# EAGLE design electrophy_RHD (EAGLE 7.2.0)
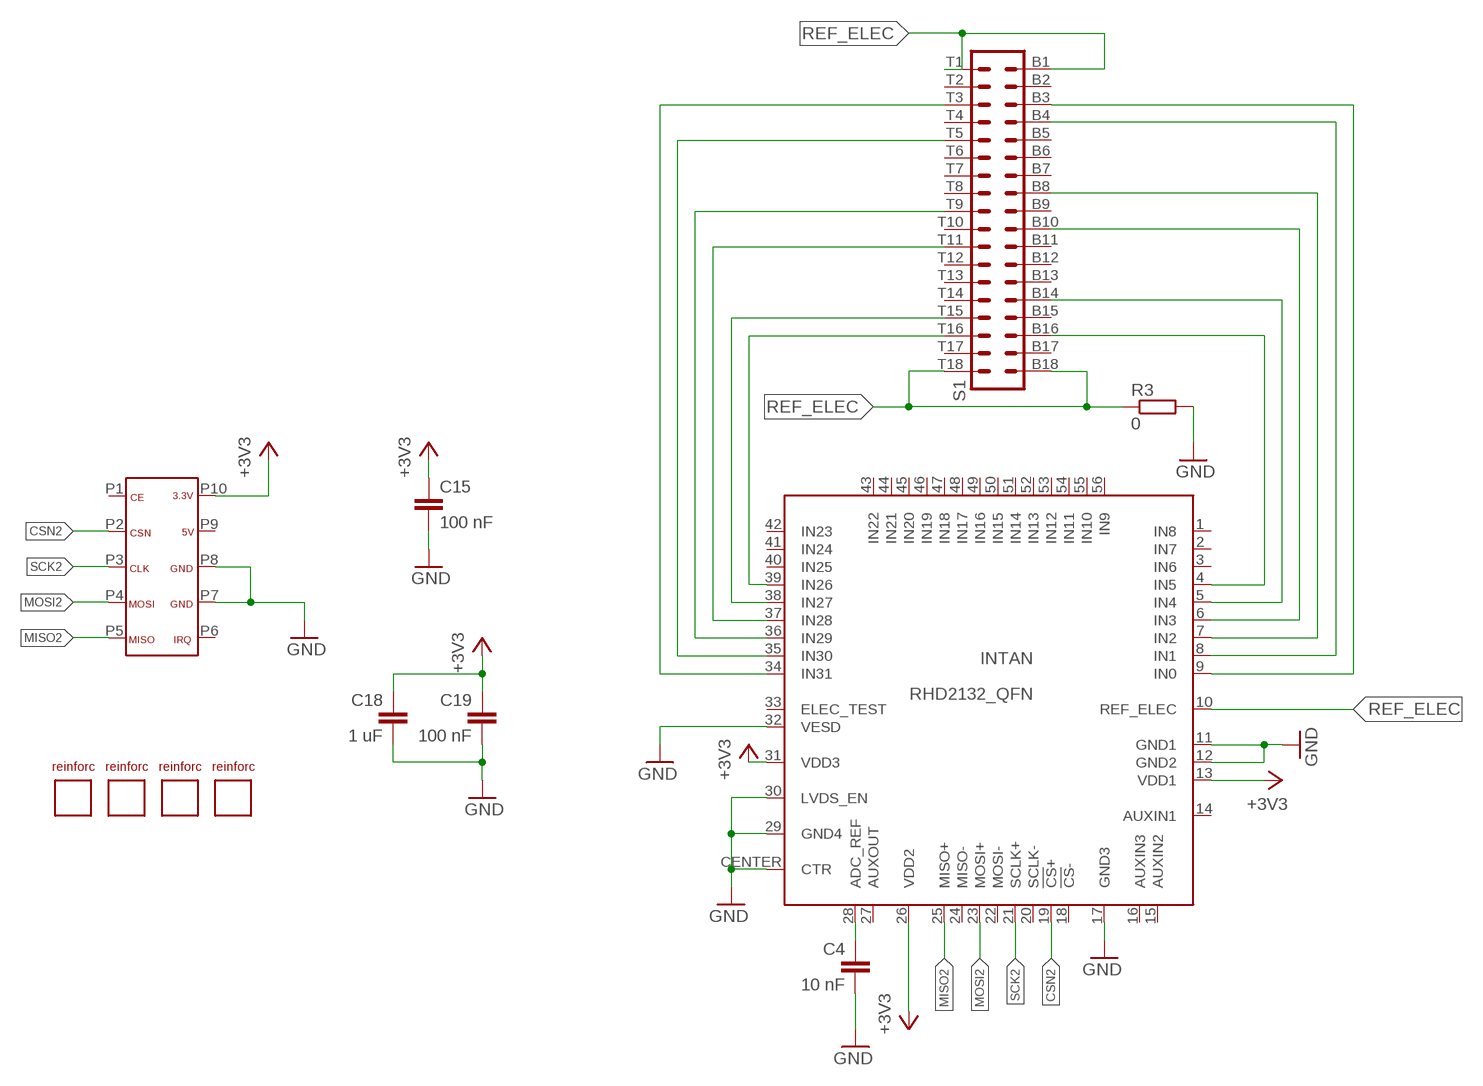
[diagram p0: schematic, sheet 1]

## Parts
C4  10 nF  C-EUC0603  [C0603]
C15  100 nF  C-EUC0603  [C0603]
C18  1 uF  C-EUC0603  [C0603]
C19  100 nF  C-EUC0603  [C0603]
INTAN  RHD2132_QFN  [QFN56_8_X_8_LARGE]
R3  0  R-EU_R0603  [R0603]
S1  OMNETICS_A79027  [OMNETICS_A79027]
U$1  DF12-10-FEMALE  [DF12-10-FEMALE]
U$2  REINFORCEMENT  [REINFORCEMENT]
U$3  REINFORCEMENT  [REINFORCEMENT]
U$4  REINFORCEMENT  [REINFORCEMENT]
U$5  REINFORCEMENT  [REINFORCEMENT]

## Nets
+3V3: C15.1 C18.1 C19.1 INTAN.13(VDD1) INTAN.26(VDD2) INTAN.31(VDD3) U$1.P10
CSN2: INTAN.19(!CS!+) U$1.P2
GND: C4.2 C15.2 C18.2 C19.2 INTAN.11(GND1) INTAN.12(GND2) INTAN.17(GND3) INTAN.29(GND4) INTAN.30(LVDS_EN) INTAN.32(VESD) INTAN.CENTER(CTR) R3.2 U$1.P7 U$1.P8
MISO2: INTAN.25(MISO+) U$1.P5
MOSI2: INTAN.23(MOSI+) U$1.P4
N$1: INTAN.4(IN5) S1.B16
N$2: INTAN.34(IN31) S1.T3
N$5: INTAN.35(IN30) S1.T5
N$6: INTAN.38(IN27) S1.T15
N$7: INTAN.39(IN26) S1.T16
N$11: C4.1 INTAN.28(ADC_REF)
N$12: INTAN.8(IN1) S1.B4
N$13: INTAN.9(IN0) S1.B3
N$15: INTAN.5(IN4) S1.B14
N$17: INTAN.7(IN2) S1.B8
N$20: INTAN.6(IN3) S1.B10
N$23: INTAN.36(IN29) S1.T9
N$26: INTAN.37(IN28) S1.T11
REF_ELEC: INTAN.10(REF_ELEC) R3.1 S1.B1 S1.B18 S1.T1 S1.T18
SCK2: INTAN.21(SCLK+) U$1.P3
Unconnected: INTAN.1(IN8) INTAN.2(IN7) INTAN.3(IN6) INTAN.14(AUXIN1) INTAN.15(AUXIN2) INTAN.16(AUXIN3) INTAN.18(!CS!-) INTAN.20(SCLK-) INTAN.22(MOSI-) INTAN.24(MISO-) INTAN.27(AUXOUT) INTAN.33(ELEC_TEST) INTAN.40(IN25) INTAN.41(IN24) INTAN.42(IN23) INTAN.43(IN22) INTAN.44(IN21) INTAN.45(IN20) INTAN.46(IN19) INTAN.47(IN18) INTAN.48(IN17) INTAN.49(IN16) INTAN.50(IN15) INTAN.51(IN14) INTAN.52(IN13) INTAN.53(IN12) INTAN.54(IN11) INTAN.55(IN10) INTAN.56(IN9) S1.B2 S1.B5 S1.B6 S1.B7 S1.B9 S1.B11 S1.B12 S1.B13 S1.B15 S1.B17 S1.T2 S1.T4 S1.T6 S1.T7 S1.T8 S1.T10 S1.T12 S1.T13 S1.T14 S1.T17 U$1.P1 U$1.P6 U$1.P9 U$2.P$1 U$3.P$1 U$4.P$1 U$5.P$1

## Library data of the parts
C4 C15 C18 C19 = resistor:C-EU: CAPACITOR, European symbol
INTAN = RHD2000:RHD2132: Intan Technologies RHD2132 chip
R3 = resistor:R-EU_: RESISTOR, European symbol
S1 = omnetics36:OMNETICS_A79027: Omnetics A79024 36-pin connector
U$1 = Hirose_DF12:DF12-10-FEMALE
U$2-U$5 = reinforcement:REINFORCEMENT

## Net classes
0 default: clearance 0.205 mm

## Board
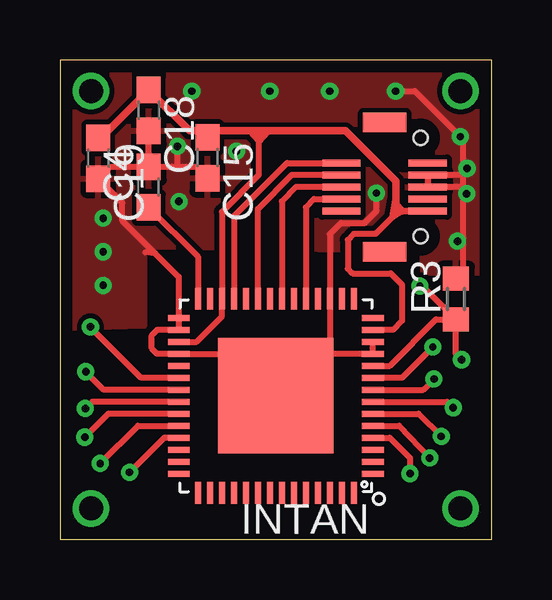
[diagram p1: board, top side]
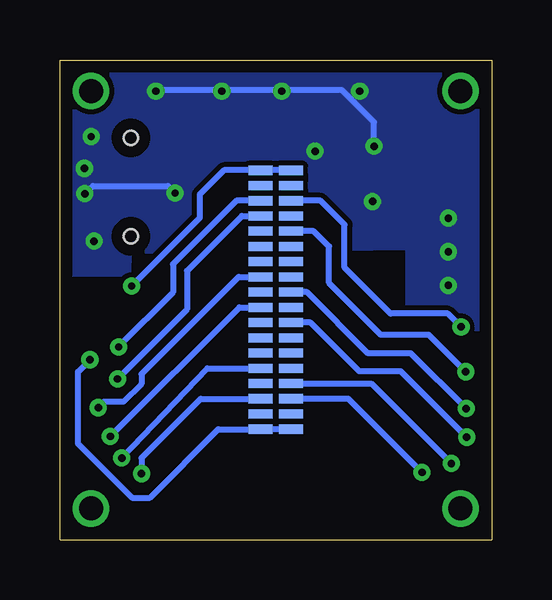
[diagram p2: board, bottom side, seen from below]

Size 18 x 20 mm. Coordinates in mm from the lower left corner, seen from the top.
Outline: 18,0 18,20 0,20 0,0 18,0
Copper layers (1*16): Top 0.035mm / dielectric 1.5mm / Bottom 0.035mm
Design rules "default *": minimum track width 8mil, minimum drill 12mil, track to track 8mil, track to pad 8mil, pad to pad 8mil, via to via 8mil, smd to smd 8mil, copper to edge 20mil, drill to drill 8mil, minimum pad ring 10mil, minimum via ring 8mil, stop-mask expansion 4mil, vias tented up to drill 12mil, thermal gap 10mil

### Footprints (pad centres in the part's own frame; a part is rotated, then mirrored left to right if it is on the bottom)
C0603 = smd 1.1 x 1: 1 -0.85,0; 2 0.85,0
QFN56_8_X_8_LARGE = smd 0.9 x 0.25: 1 -4.05,3.25; 2 -4.05,2.75; 3 -4.05,2.25; 4 -4.05,1.75; 5 -4.05,1.25; 6 -4.05,0.75; 7 -4.05,0.25; 8 -4.05,-0.25; 9 -4.05,-0.75; 10 -4.05,-1.25; 11 -4.05,-1.75; 12 -4.05,-2.25; 13 -4.05,-2.75; 14 -4.05,-3.25; 29 4.05,-3.25; 30 4.05,-2.75; 31 4.05,-2.25; 32 4.05,-1.75; 33 4.05,-1.25; 34 4.05,-0.75; 35 4.05,-0.25; 36 4.05,0.25; 37 4.05,0.75; 38 4.05,1.25; 39 4.05,1.75; 40 4.05,2.25; 41 4.05,2.75; 42 4.05,3.25 | smd 0.25 x 0.9: 15 -3.25,-4.05; 16 -2.75,-4.05; 17 -2.25,-4.05; 18 -1.75,-4.05; 19 -1.25,-4.05; 20 -0.75,-4.05; 21 -0.25,-4.05; 22 0.25,-4.05; 23 0.75,-4.05; 24 1.25,-4.05; 25 1.75,-4.05; 26 2.25,-4.05; 27 2.75,-4.05; 28 3.25,-4.05; 43 3.25,4.05; 44 2.75,4.05; 45 2.25,4.05; 46 1.75,4.05; 47 1.25,4.05; 48 0.75,4.05; 49 0.25,4.05; 50 -0.25,4.05; 51 -0.75,4.05; 52 -1.25,4.05; 53 -1.75,4.05; 54 -2.25,4.05; 55 -2.75,4.05; 56 -3.25,4.05 | smd 4.8 x 4.8: CENTER 0,0
R0603 = smd 1 x 1.1: 1 -0.85,0; 2 0.85,0
OMNETICS_A79027 = smd 0.381 x 1.016: B1 -5.397,-0.635; B2 -4.763,-0.635; B3 -4.128,-0.635; B4 -3.493,-0.635; B5 -2.857,-0.635; B6 -2.223,-0.635; B7 -1.587,-0.635; B8 -0.953,-0.635; B9 -0.318,-0.635; B10 0.318,-0.635; B11 0.953,-0.635; B12 1.587,-0.635; B13 2.223,-0.635; B14 2.857,-0.635; B15 3.493,-0.635; B16 4.128,-0.635; B17 4.763,-0.635; B18 5.397,-0.635; T1 -5.397,0.635; T2 -4.763,0.635; T3 -4.128,0.635; T4 -3.493,0.635; T5 -2.857,0.635; T6 -2.223,0.635; T7 -1.587,0.635; T8 -0.953,0.635; T9 -0.318,0.635; T10 0.318,0.635; T11 0.953,0.635; T12 1.587,0.635; T13 2.223,0.635; T14 2.857,0.635; T15 3.493,0.635; T16 4.128,0.635; T17 4.763,0.635; T18 5.397,0.635
DF12-10-FEMALE = smd 0.8 x 1.8 bottom: HOLD1 2.7,0; HOLD2 -2.7,0 | smd 0.3 x 1.6 bottom: P1 -1,-1.8; P2 -0.5,-1.8; P3 0,-1.8; P4 0.5,-1.8; P5 1,-1.8; P6 1,1.8; P7 0.5,1.8; P8 0,1.8; P9 -0.5,1.8; P10 -1,1.8 | hole 0.6: -2.05,1.5; 2.05,1.5
REINFORCEMENT = drill 1.016: P$1 0,0

### Placement (x,y rotation side)
C4  3.7,14.7 90 top
C15  6.15,15.92 270 top
C18  3.7,17.9 270 top
C19  1.6,15.9 270 top
INTAN  9,6 180 top
R3  16.51,10.03 90 top
S1  9,10 270 bottom
U$1  13.54,14.7 90 bottom
U$2  1.3,1.3 0 top
U$3  16.7,18.7 0 top
U$4  1.3,18.7 0 top
U$5  16.7,1.3 0 top

### Tracks (layer width: path | path; a pad name or v marks a point on that pad's centre or on a via)
+3V3
  Top 0.254: 1.5,16.4 1.75,16.65 | 6.13,17.05 C15.1 6.25,16.77 | C19.1 1.7,16.65 1.75,16.65 | 14,14 14,13.7 14,13.58 13.86,13.44 | 13.86,13.44 13.16,12.74 12.24,12.74 12,12.5 12,11.3 12.2,11.1 13.8,11.1 14.27,10.63 14.27,9.12 13.9,8.75 INTAN.13 | INTAN.31 5.69,8.25 6.75,9.31 INTAN.26 6.75,13.66 8.3,15.21 8.3,16.6 | 8.3,16.6 8.3,16.62 | 8.3,16.62 8.3,17.05 | 7.91,17.05 8.3,16.62 | 13.86,13.44 14.26,13.7 | 1.75,16.65 1.75,16.8 | 8.3,16.6 8.66,16.98 | 13.86,13.44 13.98,14.16
  Top 0.28: 14,13.7 14.26,13.7 U$1.P10
  Top 0.305: 14,14 14,14.95 11.9,17.05 8.3,17.05 7.91,17.05 6.13,17.05 5.4,17.05 C18.1 1.75,16.8 | 14.26,13.7 14.02,13.96
CSN2
  Top 0.254: U$1.P2 10.6,14.2 10.25,13.85 INTAN.19
GND  (via drill 0.3)
  Top 0.254: U$1.P8 U$1.P7 16.4,15.2 16.8,15.19 | C4.2 C18.2 | C4.2 2.1,15.55 C19.2 2.6,14.05 2.6,13.3 3.97,11.93 | C4.2 4.84,15.55 | 4.84,15.55 5.67,15.55 C15.2 | 4.84,15.55 4.9,15.61 v4.9,16.4 | 16.8,16.7 16.8,15.19 | 16.8,15.19 16.8,14.8 | v16.7,16.8 14.8,18.7 v14,18.7 | v13.2,14.45 13.2,13.7 12.72,13.22 12.72,13.2 11.72,13.2 11.25,12.73 INTAN.17 11.25,7.75 | 16.8,14.8 16.7,14.7 15.9,14.7 | 3.97,11.93 4.95,10.95 INTAN.29 INTAN.30 4.06,8.75 3.83,8.52 3.83,7.97 4.05,7.75 INTAN.32 7.68,7.75 7.68,7.32 arc90 INTAN.CENTER | 11.25,7.75 INTAN.11 INTAN.12 | 11.25,7.75 10.45,7.75 arc-90 10.44,7.76 | 16.8,14.8 16.8,10.88 R3.2 | 3.97,11.93 3.56,11.98
  Bottom 0.254: v4.9,16.4 4.9,17.4 6.25,18.75 13.95,18.75 v14,18.7 | v16.96,14.42 16.63,14.75 13.5,14.75 v13.2,14.45
  other vias: 1.8,13.4 4.96,14.1 1.8,12 1.8,10.6 11.25,18.7 8.75,18.7 5.5,18.7 16.58,12.44 7.36,16.19 16.98,15.48
  pour Bottom: 0.1,19.9 17.9,19.9 17.84,11.1 15.14,11.1 15.12,12.04 3.5,12.2 3.5,8.9 0.1,8.8
  pour Top: 0.1,19.9 17.9,19.9 17.83,11.11 15.15,11.11 15.12,12.03 3.5,12.2 3.5,8.9 0.1,8.8
MISO2
  Top 0.254: 11.4,15.7 U$1.P5 9.47,15.7 7.25,13.48 INTAN.25
MOSI2
  Top 0.254: INTAN.23 8.25,13.79 9.66,15.2 U$1.P4
N$1  (via drill 0.3)
  Top 0.254: INTAN.4 13.75,4.25 14.6,3.4 v14.6,2.75
  Bottom 0.254: S1.B16 12.13,5.87 14.6,3.4 v14.6,2.75
N$2  (via drill 0.3)
  Top 0.254: INTAN.34 3.39,6.75 v1.27,8.87
  Bottom 0.254: v1.27,8.87 1.82,9.42 4.21,9.42 6.13,11.34 6.13,13.13 7.13,14.13 S1.T3
N$5  (via drill 0.3)
  Top 0.254: INTAN.35 1.83,6.25 v1.08,7
  Bottom 0.254: v1.08,7 2.62,8.54 4.62,8.54 6.78,10.7 6.78,12.22 7.42,12.86 S1.T5
N$6  (via drill 0.3)
  Top 0.254: v1.68,3.17 3.26,4.75 INTAN.38
  Bottom 0.254: S1.T15 5.02,6.51 v1.68,3.17
N$7  (via drill 0.3)
  Top 0.254: INTAN.39 4.35,4.25 v2.9,2.8
  Bottom 0.254: S1.T16 5.97,5.87 v2.9,2.8
N$11
  Top 0.254: C4.1 5.75,11.8 INTAN.28
N$12  (via drill 0.3)
  Top 0.254: INTAN.8 15.15,6.25 v15.6,6.7
  Bottom 0.254: S1.B4 10.41,13.49 12.7,11.2 12.7,9.6 v15.6,6.7
N$13  (via drill 0.3)
  Top 0.254: v15.55,8.03 14.27,6.75 INTAN.9
  Bottom 0.254: S1.B3 10.64,14.13 13.29,11.48 13.29,10.31 15.55,8.05 v15.55,8.03
N$15  (via drill 0.3)
  Top 0.254: INTAN.5 14.15,4.75 v15.42,3.4
  Bottom 0.254: v15.42,3.4 11.86,7.14 S1.B14
N$17  (via drill 0.3)
  Top 0.254: INTAN.7 16.15,5.75 v16.4,5.5
  Bottom 0.254: S1.B8 10.55,10.95 14.6,6.9 14.6,6.5 15.36,5.74 16.16,5.74 v16.4,5.5
N$20  (via drill 0.3)
  Top 0.254: INTAN.6 14.95,5.25 v15.9,4.3
  Bottom 0.254: S1.B10 10.52,9.68 v15.9,4.3
N$23  (via drill 0.3)
  Top 0.254: INTAN.36 1.35,5.75 v1.06,5.46
  Bottom 0.254: S1.T9 7.7,10.32 5.15,7.77 3.37,7.77 v1.06,5.46
N$26  (via drill 0.3)
  Top 0.254: INTAN.37 2.02,5.25 v1.04,4.27
  Bottom 0.254: v1.04,4.27 3.8,7.03 5.53,7.03 7.55,9.05 S1.T11
REF_ELEC  (via drill 0.3)
  Top 0.254: INTAN.10 13.75,7.25 15.68,9.18 R3.1 | v16.75,7.5 16.51,7.74 R3.1 | v15.01,10.57 15.12,10.57 R3.1
  Bottom 0.254: S1.T1 S1.B1 11.16,15.4 12.17,14.39 12.17,13.41 v15.01,10.57 | S1.T18 S1.B18 11.4,4.6 14.25,1.75 15,1.75 17.25,4 17.25,7 v16.75,7.5
SCK2
  Top 0.254: U$1.P3 9.85,14.7 9.25,14.1 INTAN.21